# Altium project ePBR23_ACU_Latching.PrjPCB (part 2 of 2)

## Sheet 4e - Brake Detection.SchDoc
size A4
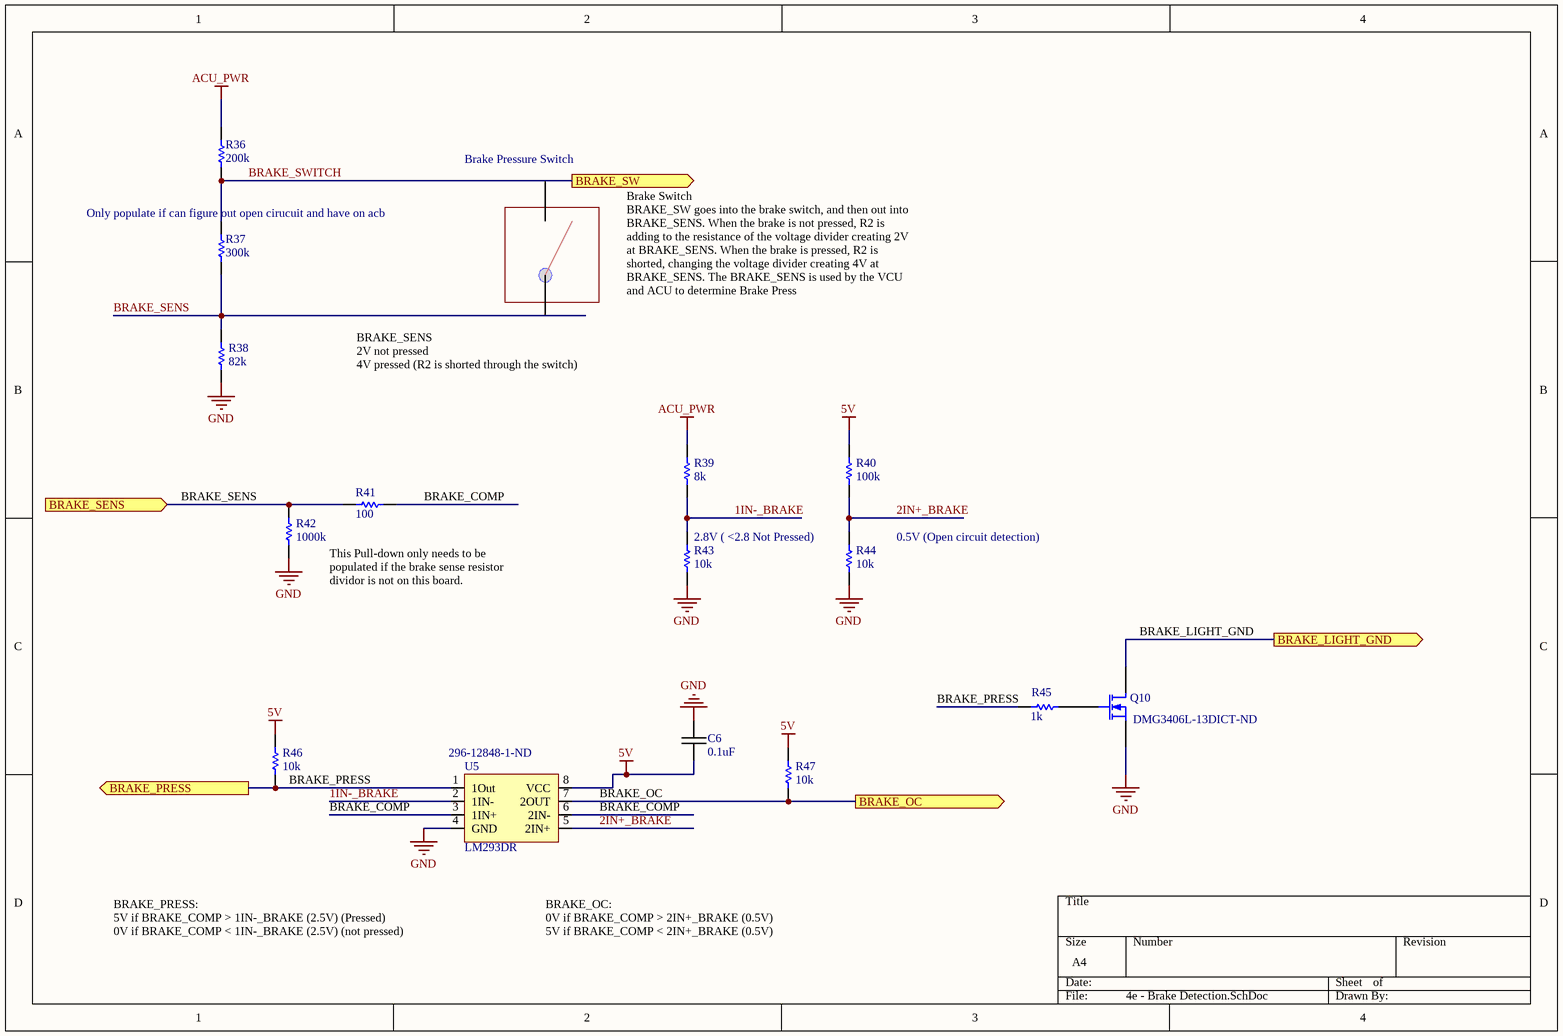
[diagram p5: 4e - Brake Detection.SchDoc]

### Parts
C6  value 0.1uF  [1608[0603]]  (hidden comment: 100nF)
Q10  Supplier Part Number 1: DMG3406L-13DICT-ND  [SOT-23_N]
R36  value 200k  [1608[0603]]  (hidden comment: Volt. Div. R1)
R37  value 300k  [1608[0603]]  (hidden comment: Volt. Div. R1)
R38  value 82k  [1608[0603]]  (hidden comment: Volt. Div. R1)
R39  Resistance (Ohms): 8k  [1608[0603]]  (hidden comment: Volt. Div. R1)
R40  Resistance (Ohms): 100k  [1608[0603]]  (hidden comment: Volt. Div. R1)
R41  value 100  [1608[0603]]  (hidden comment: Volt. Div. R2)
R42  value 1000k  [1608[0603]]  (hidden comment: Volt. Div. R2)
R43  value 10k  [1608[0603]]  (hidden comment: Volt. Div. R2)
R44  value 10k  [1608[0603]]  (hidden comment: Volt. Div. R2)
R45  1k  [RESC0603(1608)_L]
R46  value 10k  [1608[0603]]  (hidden comment: Volt. Div. R2)
R47  value 10k  [1608[0603]]  (hidden comment: Volt. Div. R2)
U5  LM293DR  Supplier Part Number 1: 296-12848-1-ND  [LM293DR]

### Ports
BRAKE_LIGHT_GND (out), BRAKE_OC (out), BRAKE_PRESS (out), BRAKE_SENS (in), BRAKE_SW (out)

### Nets
5V: C6.1 R40.2 R46.2 R47.2 U5.8(VCC)
ACU_PWR: R36.2 R39.2
GND: C6.2 Q10.2(S) R38.1 R42.1 R43.1 R44.1 U5.4(GND)
1IN-_BRAKE: R39.1 R43.2 U5.2(1IN-)
2IN+_BRAKE: R40.1 R44.2 U5.5(2IN+)
BRAKE_COMP: R41.1 U5.3(1IN+) U5.6(2IN-)
BRAKE_LIGHT_GND: Q10.3(D) ; port BRAKE_LIGHT_GND
BRAKE_OC: R47.1 U5.7(2OUT) ; port BRAKE_OC
BRAKE_PRESS: R45.1 R46.1 U5.1(1Out) ; port BRAKE_PRESS
BRAKE_SENS: R37.2 R38.2 R41.2 R42.2 ; port BRAKE_SENS
BRAKE_SWITCH: R36.1 R37.1 ; port BRAKE_SW  [project net BRAKE_SW]
NetQ10_1: Q10.1(G) R45.2

### Notes on the sheet
- Brake Pressure Switch
- (near R37) Only populate if can figure out open cirucuit and have on acb
- Brake Switch
  BRAKE_SW goes into the brake switch, and then out into BRAKE_SENS. When the brake is not pressed, R2 is adding to the resistance of the voltage divider creating 2V at BRAKE_SENS. When the brake is pressed, R2 is shorted, changing the voltage divider creating 4V at BRAKE_SENS. The BRAKE_SENS is used by the VCU and ACU to determine Brake Press
- BRAKE_SENS
  2V not pressed
  4V pressed (R2 is shorted through the switch)
- 2.8V ( <2.8 Not Pressed)
- 0.5V (Open circuit detection)
- This Pull-down only needs to be populated if the brake sense resistor dividor is not on this board.
- BRAKE_PRESS:
  5V if BRAKE_COMP > 1IN-_BRAKE (2.5V) (Pressed)
  0V if BRAKE_COMP < 1IN-_BRAKE (2.5V) (not pressed)
- BRAKE_OC:
  0V if BRAKE_COMP > 2IN+_BRAKE (0.5V)
  5V if BRAKE_COMP < 2IN+_BRAKE (0.5V)

### Library data of the parts
C6 = 0805C-100nF-25V-X7R-MUR: CAP CER 0.1UF 50V X7R 0603; Manufacturer: Kemet; Manufacturer Part Number: C0603C104K5RACAUTO; Capacitance: 0.1µF; Tolerance: ±10%; Supplier 1: Digi-Key; Supplier Part Number 1: 399-6856-1-ND; RoHS: RoHS Compliant; Category: Capacitors; Stock 1: 157876; Pricing 1: 1=0.14, 10=0.095, 25=0.0672, 50=0.0514, 100=0.0435, 250=0.03556, 1000=0.02324 (CAD); Packaging: Cut Tape (CT); Voltage - Rated: 50V; Temperature Coefficient: X7R; Mounting Type: Surface Mount, MLCC; Operating Temperature: -55°C ~ 125°C; Applications: Automotive; Ratings: AEC-Q200; Package / Case: 0603 (1608 Metric); Size / Dimension: 0.063" L x 0.031" W (1.60mm x 0.80mm); Height - Seated (Max): -; Thickness (Max): 0.034" (0.87mm); Lead Spacing: -; Features: -; Lead Style: -; ComponentLink1URL: http://capacitoredge.kemet.com/capedge2/DataSheet?pn=C0603C104K5RACAUTO; ComponentLink1Description: http://capacitoredge.kemet.com/capedge2/DataSheet?pn=C0603C104K5RACAUTO
Q10 = MOSFET-N: N-Channel MOSFET; Manufacturer: Infineon Technologies; FET Type: MOSFET N-Channel, Metal Oxide; FET Feature: Logic Level Gate; Drain to Source Voltage (Vdss): 30V; Current - Continuous Drain (Id) @ 25°C: 50A (Tc); Rds On (Max) @ Id, Vgs: 7.5 mOhm @ 30A, 10V; Vgs(th) (Max) @ Id: 2.2V @ 250µA; Gate Charge (Qg) @ Vgs: 18nC @ 10V; Input Capacitance (Ciss) @ Vds: 1900pF @ 15V; Power - Max: 47W; Published: 8-Jun-2000; LatestRevisionDate: 17-Jul-2002; LatestRevisionNote: Re-released for DXP Platform.; PackageVersion: 1995/1996; PackageReference: E3; Publisher: Altium Limited; PackageDescription: TO, Flat Index; 3 In-Line, Axial Leads; Body Dia. 4.6mm; Lead Dia. 0.5 mm (max); RoHS: RoHS Compliant; Category: Discrete Semiconductor Products; Packaging: Cut Tape (CT); Mounting Type: Surface Mount; Package / Case: TO-252-3, DPak (2 Leads + Tab), SC-63; Supplier Device Package: PG-TO252-3; ComponentLink1URL: http://www.infineon.com/dgdl/Infineon-IPD075N03LG-DS-v02_01-en.pdf?folderId=5546d4694909da4801490a07012f053b&fileId=db3a30431936bc4b011951d824f83aeb; ComponentLink1Description: http://www.infineon.com/dgdl/Infineon-IPD075N03LG-DS-v02_01-en.pdf?folderId=5546d4694909da4801490a07012f053b&fileId=db3a30431936bc4b011951d824f83aeb; ComponentLink2URL: http://www.semicon.toshiba.co.jp/info/docget.jsp?type=datasheet&lang=en&pid=SSM3K329R; ComponentLink2Description: http://www.semicon.toshiba.co.jp/info/docget.jsp?type=datasheet&lang=en&pid=SSM3K329R; Supplier 1: Digi-Key
R36-R38 = Res1: RES SMD 10K OHM 5% 1/4W 0603; Manufacturer: Rohm Semiconductor; Manufacturer Part Number: ESR03EZPJ103; Power (Watts): 0.25W, 1/4W; Temperature Coefficient: ±200ppm/°C; Published: 8-Jun-2000; LatestRevisionDate: 17-Jul-2002; LatestRevisionNote: Re-released for DXP Platform.; PackageReference: AXIAL-0.3; Publisher: Altium Limited; PackageDescription: Axial Device, Thru-Hole; 2 Leads; 0.3 in Pin Spacing; RoHS: RoHS Compliant; Category: Resistors; Stock 1: 8780; Pricing 1: 1=0.15, 10=0.121, 25=0.0832, 100=0.0463, 250=0.03604, 500=0.02866, 1000=0.02033 (CAD); Packaging: Cut Tape (CT); Resistance (Ohms): 10k; Tolerance: ±5%; Composition: Thick Film; Features: Automotive AEC-Q200, Pulse Withstanding; Operating Temperature: -55°C ~ 155°C; Package / Case: 0603 (1608 Metric); Supplier Device Package: 0603 (1608 Metric); Size / Dimension: 0.063" L x 0.031" W (1.60mm x 0.80mm); Height: 0.022" (0.55mm); Number of Terminations: 2; ComponentLink1URL: http://rohmfs.rohm.com/en/products/databook/datasheet/passive/resistor/chip_resistor/esr.pdf; ComponentLink1Description: http://rohmfs.rohm.com/en/products/databook/datasheet/passive/resistor/chip_resistor/esr.pdf; Supplier 1: Digi-Key
  R36: Supplier Part Number 1: 311-200KGRCT-ND
  R37: Supplier Part Number 1: 311-300KGRCT-ND
  R38: Supplier Part Number 1: YAG3633CT-ND
R39 R40 = Res1: RES SMD 6.8K OHM 5% 1/4W 0603; Manufacturer: Rohm Semiconductor; Manufacturer Part Number: ESR03EZPJ682; Power (Watts): 0.25W, 1/4W; Temperature Coefficient: ±200ppm/°C; RoHS: RoHS Compliant; Category: Resistors; Stock 1: 2440; Pricing 1: 1=0.15, 10=0.119, 25=0.0824, 50=0.0642, 100=0.0458, 250=0.03568, 500=0.02836, 1000=0.02012 (CAD); Packaging: Cut Tape (CT); Part Status: Active; Tolerance: ±5%; Composition: Thick Film; Features: Automotive AEC-Q200, Pulse Withstanding; Operating Temperature: -55°C ~ 155°C; Package / Case: 0603 (1608 Metric); Supplier Device Package: 0603; Size / Dimension: 0.063" L x 0.031" W (1.60mm x 0.80mm); Height - Seated (Max): 0.022" (0.55mm); Failure Rate: -; ComponentLink1URL: http://rohmfs.rohm.com/en/products/databook/datasheet/passive/resistor/chip_resistor/esr.pdf; ComponentLink1Description: http://rohmfs.rohm.com/en/products/databook/datasheet/passive/resistor/chip_resistor/esr.pdf; Supplier 1: Digi-Key
  R39: Supplier Part Number 1: 311-300KGRCT-ND
  R40: Supplier Part Number 1: 311-100KHRCT-ND
R41-R44 R46 R47 = Res1: RES SMD 20K OHM 5% 1/4W 0603; Manufacturer: Rohm Semiconductor; Manufacturer Part Number: ESR03EZPJ203; Power (Watts): 0.25W, 1/4W; Temperature Coefficient: ±200ppm/°C; Published: 8-Jun-2000; LatestRevisionDate: 17-Jul-2002; LatestRevisionNote: Re-released for DXP Platform.; PackageReference: AXIAL-0.3; Publisher: Altium Limited; PackageDescription: Axial Device, Thru-Hole; 2 Leads; 0.3 in Pin Spacing; RoHS: RoHS Compliant; Category: Resistors; Stock 1: 50602; Pricing 1: 1=0.15, 10=0.121, 25=0.0832, 100=0.0463, 250=0.03604, 500=0.02866, 1000=0.02033 (CAD); Packaging: Cut Tape (CT); Resistance (Ohms): 20k; Tolerance: ±5%; Composition: Thick Film; Features: Automotive AEC-Q200, Pulse Withstanding; Operating Temperature: -55°C ~ 155°C; Package / Case: 0603 (1608 Metric); Supplier Device Package: 0603 (1608 Metric); Size / Dimension: 0.063" L x 0.031" W (1.60mm x 0.80mm); Height: 0.022" (0.55mm); Number of Terminations: 2; ComponentLink1URL: http://rohmfs.rohm.com/en/products/databook/datasheet/passive/resistor/chip_resistor/esr.pdf; ComponentLink1Description: http://rohmfs.rohm.com/en/products/databook/datasheet/passive/resistor/chip_resistor/esr.pdf; Supplier 1: Digi-Key
  R41: Supplier Part Number 1: 311-100HRDKR-ND
  R42: Supplier Part Number 1: 311-1.00MHRCT-ND
  R43: Supplier Part Number 1: YAG3633CT-ND
  R44 R46 R47: Supplier Part Number 1: 311-10KGRCT-ND
R45 = CMP-1591-00001-1: 0603 (1608 Metric) Chip Resistor; Case-Metric: 1608; Case-EIA: 0603; Value: 1k; PackageReference: RESC0603(1608); Supplier 1: Digi-Key; Supplier Part Number 1: 311-1.0KGRCT-ND
U5 = LM293DR: IC Dual Comparator; Supplier 1: Digi-Key

## Sheet 5  - TSAL.SchDoc
size A4
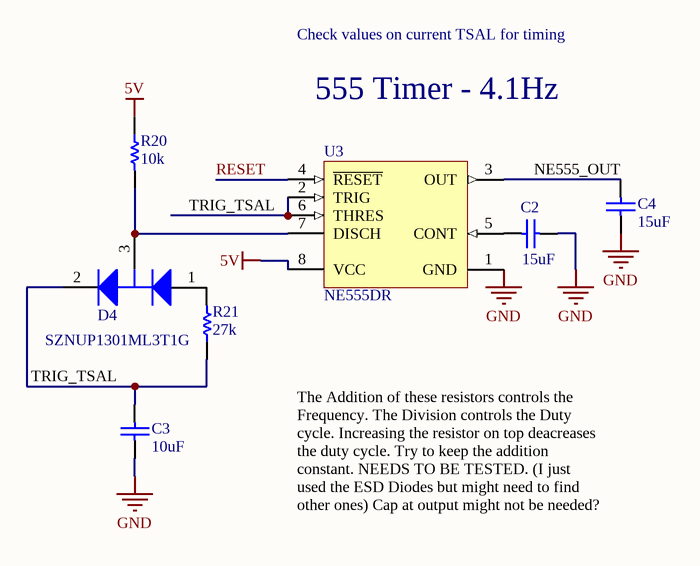
[diagram p6: 5  - TSAL.SchDoc]

### Parts
(Parts that share a designator on the sheet are numbered #1, #2 ... from top to bottom, then left to right.)
C2#2  value 15uF  [1608[0603]]  (hidden comment: Cap)
C3#2  value 10uF  [1608[0603]]  (hidden comment: Cap)
C4#2  value 15uF  [1608[0603]]  (hidden comment: Cap)
D4#2  SZNUP1301ML3T1G  [ONSC-SOT-23-3-318-08_V]
R20#2  10k  [RESC0603(1608)_L]
R21#2  27k  [RESC0603(1608)_L]
U3#2  NE555DR  [D0008A_M]

### Nets
5V: R20#2.1 U3#2.8(VCC)
GND: C2#2.2 C3#2.1 C4#2.1 U3#2.1(GND)
NE555_OUT: C4#2.2 U3#2.3(OUT)
RESET: U3#2.4(~{RESET})
TRIG_TSAL: C3#2.2 D4#2.2(K) R21#2.1 U3#2.2(TRIG) U3#2.6(THRES)
NetC2#2_1: C2#2.1 U3#2.5(CONT)
NetD4#2_1: D4#2.1(A) R21#2.2
NetD4#2_3: D4#2.3(K/A) R20#2.2 U3#2.7(DISCH)

### Notes on the sheet
- Check values on current TSAL for timing
- 555 Timer - 4.1Hz
- The Addition of these resistors controls the Frequency. The Division controls the Duty cycle. Increasing the resistor on top deacreases the duty cycle. Try to keep the addition constant. NEEDS TO BE TESTED. (I just used the ESD Diodes but might need to find other ones) Cap at output might not be needed? Cap from 12V to GND might be needed.

### Library data of the parts
C2#2 C3#2 C4#2 = Cap: Capacitor; Published: 8-Jun-2000; LatestRevisionDate: 17-Jul-2002; LatestRevisionNote: Re-released for DXP Platform.; PackageReference: RAD-0.3; Publisher: Altium Limited; PackageDescription: Radial Cap, Thru-Hole; 2 Leads; 0.3 in Pin Spacing; Supplier 1: Digi-Key
  C2#2 C4#2: Supplier Part Number 1: 445-11189-1-ND
  C3#2: Supplier Part Number 1: 490-10991-1-ND
D4#2 = CMP-1063-00171-1: Low Capacitance Diode Array for ESD Protection in a Single Data Line, 3-Pin SOT-23, Pb-Free, Tape and Reel; Manufacturer: On Semiconductor; C Max (pF): 0.9; Direction: Bidirectional; V(BR) Min (V): 70; Number of Lines: 1; Mounting Technology: Surface Mount; PackageReference: SOT-23-3-318-08; DatasheetVersion: Rev. 6; PackageVersion: Rev. AP, 11/2009; RoHS: Pb-Free; ComponentLink1Description: Manufacturer URL; ComponentLink1URL: http://www.onsemi.com/; PackageDescription: 3-Pin Small Outline Transistor, Body 2.92 x 1.3 mm, Pitch 0.95 mm; PartNumber: SZNUP1301ML3T1G; Packing: Tape and Reel; ComponentLink3URL: http://www.onsemi.cn/pub_link/Collateral/318-08.PDF; ComponentLink3Description: Package Specification; VRWM Max (V): 70; ComponentLink2Description: Datasheet; ComponentLink2URL: http://www.onsemi.cn/pub_link/Collateral/NUP1301ML3T1-D.PDF; Supplier 1: Digi-Key; Supplier Part Number 1: SZNUP1301ML3T1GOSCT-ND
R20#2 R21#2 = CMP-1591-00001-1: 0603 (1608 Metric) Chip Resistor; Value: 1k; Case-Metric: 1608; Case-EIA: 0603; PackageReference: RESC0603(1608); Supplier 1: Digi-Key
  R20#2: Supplier Part Number 1: 311-10KGRCT-ND
  R21#2: Supplier Part Number 1: 311-27KGRCT-ND
U3#2 = CMP-1685-00007-1: Precision Timer, 4.5 to 16 V, 0 to 70 degC, 8-Pin SOIC (D8), Green (RoHS & no Sb/Br), Tape and Reel; Forward Voltage: 450 mV; Forward Current: 1 A; Max Surge Current: 30 A; Peak Reverse Current: 500 uA; Case\Package: SMA; PackageReference: D0008A; Width: 2.84 mm; PackageDescription: 8-Pin Small Outline Integrated Circuit, Body 4.9 x 3.9 mm, Pitch 1.27 mm; DatasheetVersion: SLFS022I, 09/2014; ComponentLink2Description: Datasheet; Package Quantity: 1; REACH SVHC: Unknown; Radiation Hardening: No; Height: 2.44 mm; Code_JEDEC: MS-012; Pins: 2; ComponentLink1Description: Manufacturer URL; ComponentLink3Description: Package Specification; ComponentLink3URL: http://www.ti.com/lit/ml/msoi002j/msoi002j.pdf; Length: 4.57 mm; ComponentLink1URL: http://www.ti.com/; Mount: Surface Mount; PackageVersion: 4040047-3/M, 06/2011; ComponentLink2URL: http://www.ti.com/general/docs/lit/getliterature.tsp?genericPartNumber=NE555&fileType=pdf; RoHSCompliant: true; Max Operating Temperature: 125 degC; Packaging: Cut Tape; Min Operating Temperature: -55 degC; Supplier 1: Digi-Key; Supplier Part Number 1: 296-6501-2-ND

## Nets that join several sheets
5V: 4  - Latching (D1.2 J2.A2), 4d - BSPD Detection Timer (11 pins), 4e - Brake Detection (5 pins), 5  - TSAL (R20#2.1 U3#2.8)
ACU_PWR: 4  - Latching (J1.A1), 4e - Brake Detection (R36.2 R39.2)
GND: 4  - Latching (5 pins), 4b - Latching IMD (5 pins), 4c - Latching BSPD (BSPD1.22 Q8.2 Q9.2 R20#1.1), 4a - Latching AMS (AMS1.22 Q2.2 Q3.2 R6.1), 4d - BSPD Detection Timer (14 pins), 4e - Brake Detection (7 pins), 5  - TSAL (C2#2.2 C3#2.1 C4#2.1 U3#2.1)
LATCHING_Delayed: 4  - Latching (J4.A3), 4b - Latching IMD (5 pins), 4c - Latching BSPD (6 pins), 4a - Latching AMS (7 pins)
~{AMS_OK}: 4  - Latching (J4.A2), 4a - Latching AMS (R5.1 R8.1)
AMS_LED: 4  - Latching (J4.A1), 4a - Latching AMS (AMS1.21 D2.2)
AMS_OK: 4  - Latching (J4.A4), 4a - Latching AMS (Q2.3 R2.2 R4.1)
~{BSPD_OK}: 4c - Latching BSPD (R19.1 R22.1), 4d - BSPD Detection Timer (U3#1.4)
BRAKE_LIGHT_GND: 4  - Latching (J2.A6), 4e - Brake Detection (Q10.3)
BRAKE_OC: 4d - BSPD Detection Timer (U3#1.3), 4e - Brake Detection (R47.1 U5.7)
BRAKE_PRESS: 4  - Latching (J2.A3), 4d - BSPD Detection Timer (U4.1), 4e - Brake Detection (R45.1 R46.1 U5.1)
BRAKE_SENS: 4  - Latching (J2.A4), 4e - Brake Detection (R37.2 R38.2 R41.2 R42.2)
BRAKE_SW: 4  - Latching (J2.A5), 4e - Brake Detection (R36.1 R37.1)
BSPD_LED: 4  - Latching (J3.A4), 4c - Latching BSPD (BSPD1.21 D8.2)
IMD_LED: 4  - Latching (J4.A6), 4b - Latching IMD (D6.2 IMD1.21)
IMD_OK: 4  - Latching (J3.A5), 4b - Latching IMD (R10.1 R14.2 R15.1)
LATCH_RST: 4  - Latching (J3.A2), 4b - Latching IMD (Q4.2 R11.2), 4c - Latching BSPD (Q7.2 R20#1.2), 4a - Latching AMS (Q1.2 R6.2)
SCHT_AMS_IMD: 4  - Latching (JMP1.1 JMP2.2), 4b - Latching IMD (IMD1.12), 4a - Latching AMS (AMS1.11)
SCHT_IMD_BSPD: 4  - Latching (JMP2.1 JMP3.2), 4b - Latching IMD (IMD1.11), 4c - Latching BSPD (BSPD1.12)
SCHT_IN_LATCH: 4  - Latching (J4.A5 JMP1.2), 4a - Latching AMS (AMS1.12)
SCHT_OUT_LATCH: 4  - Latching (J3.A1 JMP3.1), 4c - Latching BSPD (BSPD1.11)
TS_CURR_SENS: 4  - Latching (J2.A1), 4d - BSPD Detection Timer (R28.2 R30.2)